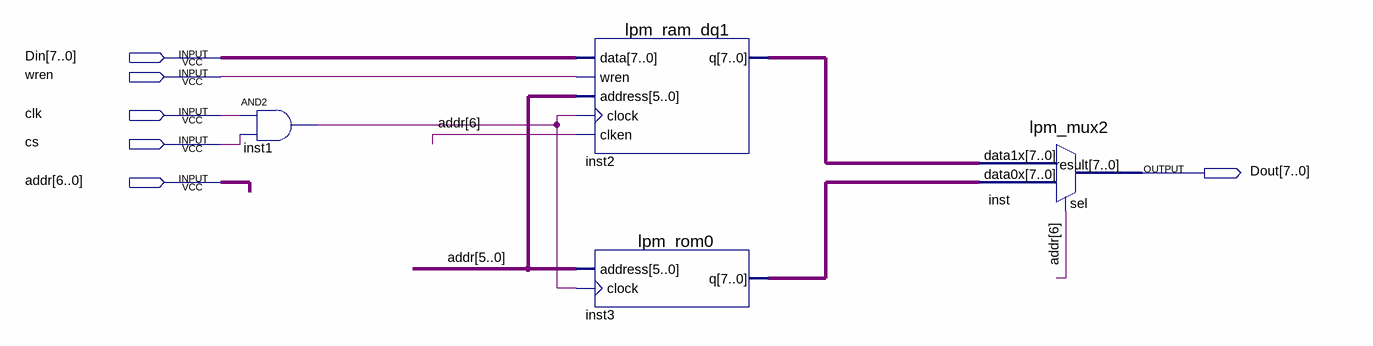
[diagram p0: schematic sheet]
// Quartus schematic module.bdf as structural Verilog: 4 symbols, 6 pins
module \module  (
  input  [7:0] Din,
  input  wren,
  input  clk,
  input  cs,
  input  [6:0] addr,
  output [7:0] Dout
);

  wire inst1_out;
  wire [7:0] inst2_q, inst3_q;

  and inst1 (inst1_out, clk, cs);
  lpm_ram_dq1 inst2 (.data(Din), .wren(wren), .address(addr[5:0]), .clock(inst1_out), .clken(addr[6]), .q(inst2_q));
  lpm_rom0 inst3 (.address(addr[5:0]), .clock(inst1_out), .q(inst3_q));
  lpm_mux2 inst (.data1x(inst2_q), .data0x(inst3_q), .sel(addr[6]), .result(Dout));
endmodule
